# Altium schematic sheet [1]SheetMain.SchDoc: SheetMain
size A4; Organization: Altium Limited; Address1: SPARC Lab; Address2: SEEE-HUST; Address3: Dai Co Viet, Ha Noi; DocumentNumber: 1; SheetNumber: 1; SheetTotal: 5
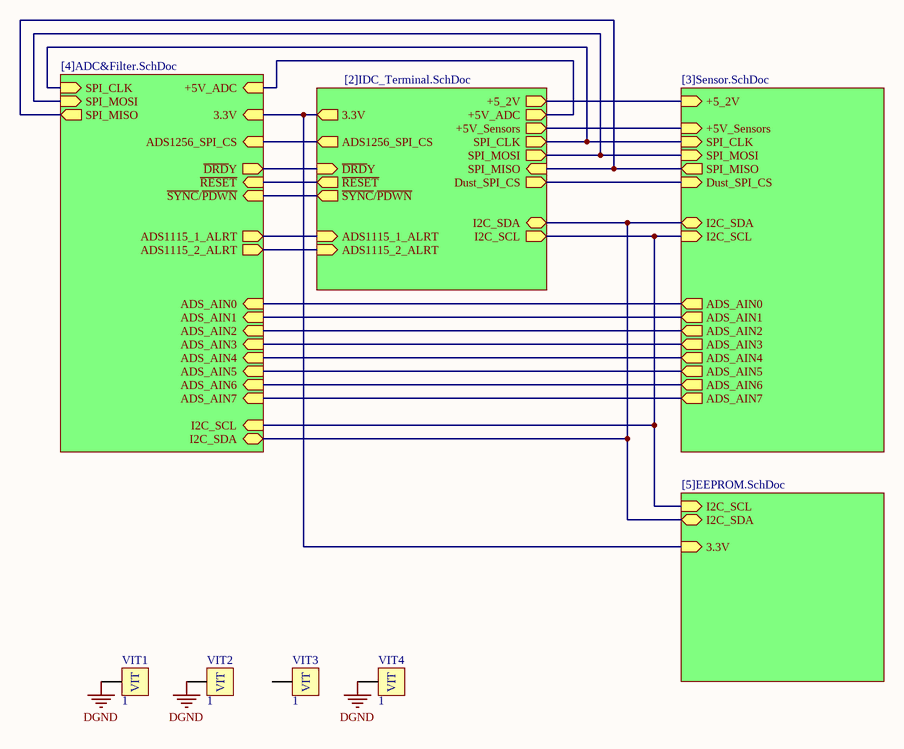
[diagram p0: [1]SheetMain.SchDoc]

## Parts
VIT1  1  [Screw Hole 4mm]
VIT2  1  [Screw Hole 4mm]
VIT3  1  [Screw Hole 4mm]
VIT4  1  [Screw Hole 4mm]

## Sub-sheets
U_[2]IDC_Terminal = [2]IDC_Terminal.SchDoc: 3.3V (out), Dust_SPI_CS (out), SPI_MISO (in), SPI_MOSI (out), SPI_CLK (out), ADS1256_SPI_CS (out), ~{DRD}Y (in), ~{RESET} (out), ~{SYNC}/~{PDWN} (out), I2C_SCL (out), I2C_SDA (bidir), ADS1115_1_ALRT (in), ADS1115_2_ALRT (in), +5_2V (out), +5V_Sensors (out), +5V_ADC (out)
U_[3]Sensor = [3]Sensor.SchDoc: +5_2V (in), SPI_CLK (in), SPI_MISO (out), SPI_MOSI (in), Dust_SPI_CS (in), ADS_AIN0 (out), +5V_Sensors (in), ADS_AIN4 (out), ADS_AIN7 (out), ADS_AIN6 (out), ADS_AIN5 (out), ADS_AIN1 (out), ADS_AIN3 (out), ADS_AIN2 (out), I2C_SDA (bidir), I2C_SCL (in)
U_[4]ADC&Filter = [4]ADC&Filter.SchDoc: ADS_AIN3 (in), ~{DRD}Y (out), ADS1256_SPI_CS (in), ~{RESET} (in), ~{SYNC}/~{PDWN} (in), SPI_MISO (out), +5V_ADC (in), 3.3V (in), ADS_AIN2 (in), ADS_AIN6 (in), ADS_AIN1 (in), ADS_AIN4 (in), ADS_AIN5 (in), ADS_AIN7 (in), SPI_MOSI (in), SPI_CLK (in), ADS_AIN0 (in), I2C_SCL (in), ADS1115_1_ALRT (out), ADS1115_2_ALRT (out), I2C_SDA (bidir)
U_[5]EEPROM = [5]EEPROM.SchDoc: I2C_SCL (in), I2C_SDA (bidir), 3.3V (in)

## Nets
DGND: VIT1.1 VIT2.1 VIT4.1
(unnamed): sheet U_[2]IDC_Terminal/3.3V, sheet U_[4]ADC&Filter/3.3V, sheet U_[5]EEPROM/3.3V
(unnamed): sheet U_[2]IDC_Terminal/Dust_SPI_CS, sheet U_[3]Sensor/Dust_SPI_CS
(unnamed): sheet U_[2]IDC_Terminal/SPI_MISO, sheet U_[3]Sensor/SPI_MISO, sheet U_[4]ADC&Filter/SPI_MISO
(unnamed): sheet U_[2]IDC_Terminal/SPI_MOSI, sheet U_[3]Sensor/SPI_MOSI, sheet U_[4]ADC&Filter/SPI_MOSI
(unnamed): sheet U_[2]IDC_Terminal/SPI_CLK, sheet U_[3]Sensor/SPI_CLK, sheet U_[4]ADC&Filter/SPI_CLK
(unnamed): sheet U_[2]IDC_Terminal/ADS1256_SPI_CS, sheet U_[4]ADC&Filter/ADS1256_SPI_CS
(unnamed): sheet U_[2]IDC_Terminal/~{DRD}Y, sheet U_[4]ADC&Filter/~{DRD}Y
(unnamed): sheet U_[2]IDC_Terminal/~{RESET}, sheet U_[4]ADC&Filter/~{RESET}
(unnamed): sheet U_[2]IDC_Terminal/~{SYNC}/~{PDWN}, sheet U_[4]ADC&Filter/~{SYNC}/~{PDWN}
(unnamed): sheet U_[2]IDC_Terminal/I2C_SCL, sheet U_[3]Sensor/I2C_SCL, sheet U_[4]ADC&Filter/I2C_SCL, sheet U_[5]EEPROM/I2C_SCL
(unnamed): sheet U_[2]IDC_Terminal/I2C_SDA, sheet U_[3]Sensor/I2C_SDA, sheet U_[4]ADC&Filter/I2C_SDA, sheet U_[5]EEPROM/I2C_SDA
(unnamed): sheet U_[2]IDC_Terminal/ADS1115_1_ALRT, sheet U_[4]ADC&Filter/ADS1115_1_ALRT
(unnamed): sheet U_[2]IDC_Terminal/ADS1115_2_ALRT, sheet U_[4]ADC&Filter/ADS1115_2_ALRT
(unnamed): sheet U_[2]IDC_Terminal/+5_2V, sheet U_[3]Sensor/+5_2V
(unnamed): sheet U_[2]IDC_Terminal/+5V_Sensors, sheet U_[3]Sensor/+5V_Sensors
(unnamed): sheet U_[2]IDC_Terminal/+5V_ADC, sheet U_[4]ADC&Filter/+5V_ADC
(unnamed): sheet U_[3]Sensor/ADS_AIN0, sheet U_[4]ADC&Filter/ADS_AIN0
(unnamed): sheet U_[3]Sensor/ADS_AIN4, sheet U_[4]ADC&Filter/ADS_AIN4
(unnamed): sheet U_[3]Sensor/ADS_AIN7, sheet U_[4]ADC&Filter/ADS_AIN7
(unnamed): sheet U_[3]Sensor/ADS_AIN6, sheet U_[4]ADC&Filter/ADS_AIN6
(unnamed): sheet U_[3]Sensor/ADS_AIN5, sheet U_[4]ADC&Filter/ADS_AIN5
(unnamed): sheet U_[3]Sensor/ADS_AIN1, sheet U_[4]ADC&Filter/ADS_AIN1
(unnamed): sheet U_[3]Sensor/ADS_AIN3, sheet U_[4]ADC&Filter/ADS_AIN3
(unnamed): sheet U_[3]Sensor/ADS_AIN2, sheet U_[4]ADC&Filter/ADS_AIN2

Not connected (* = marked no-connect by the designer): VIT3 1

## Notes on the sheet
- Title
- Size:
- Date:
- A4
- Number:
- Time:
- Revision:
- Sheet
- of
- File:

## Library data of the parts
VIT1-VIT4 = VIT: Vit xuyen lo; Chung_Loai: Cắm; Ma_Hang: MH002051; Ten_Linh_Kien: CON 2 KF142R 5.08MM; Don_Vi: Con; Ghi_Chu: *; Kieu_Chan: *